# Altium schematic sheet RelayCard_LED_Monitor.SchDoc: Relay Card LED Monitor
size Tabloid; Date: 05/10/2023; Engineer: Terry D. Schevker; Revision: 1.0; SheetNumber: 2; SheetTotal: 2
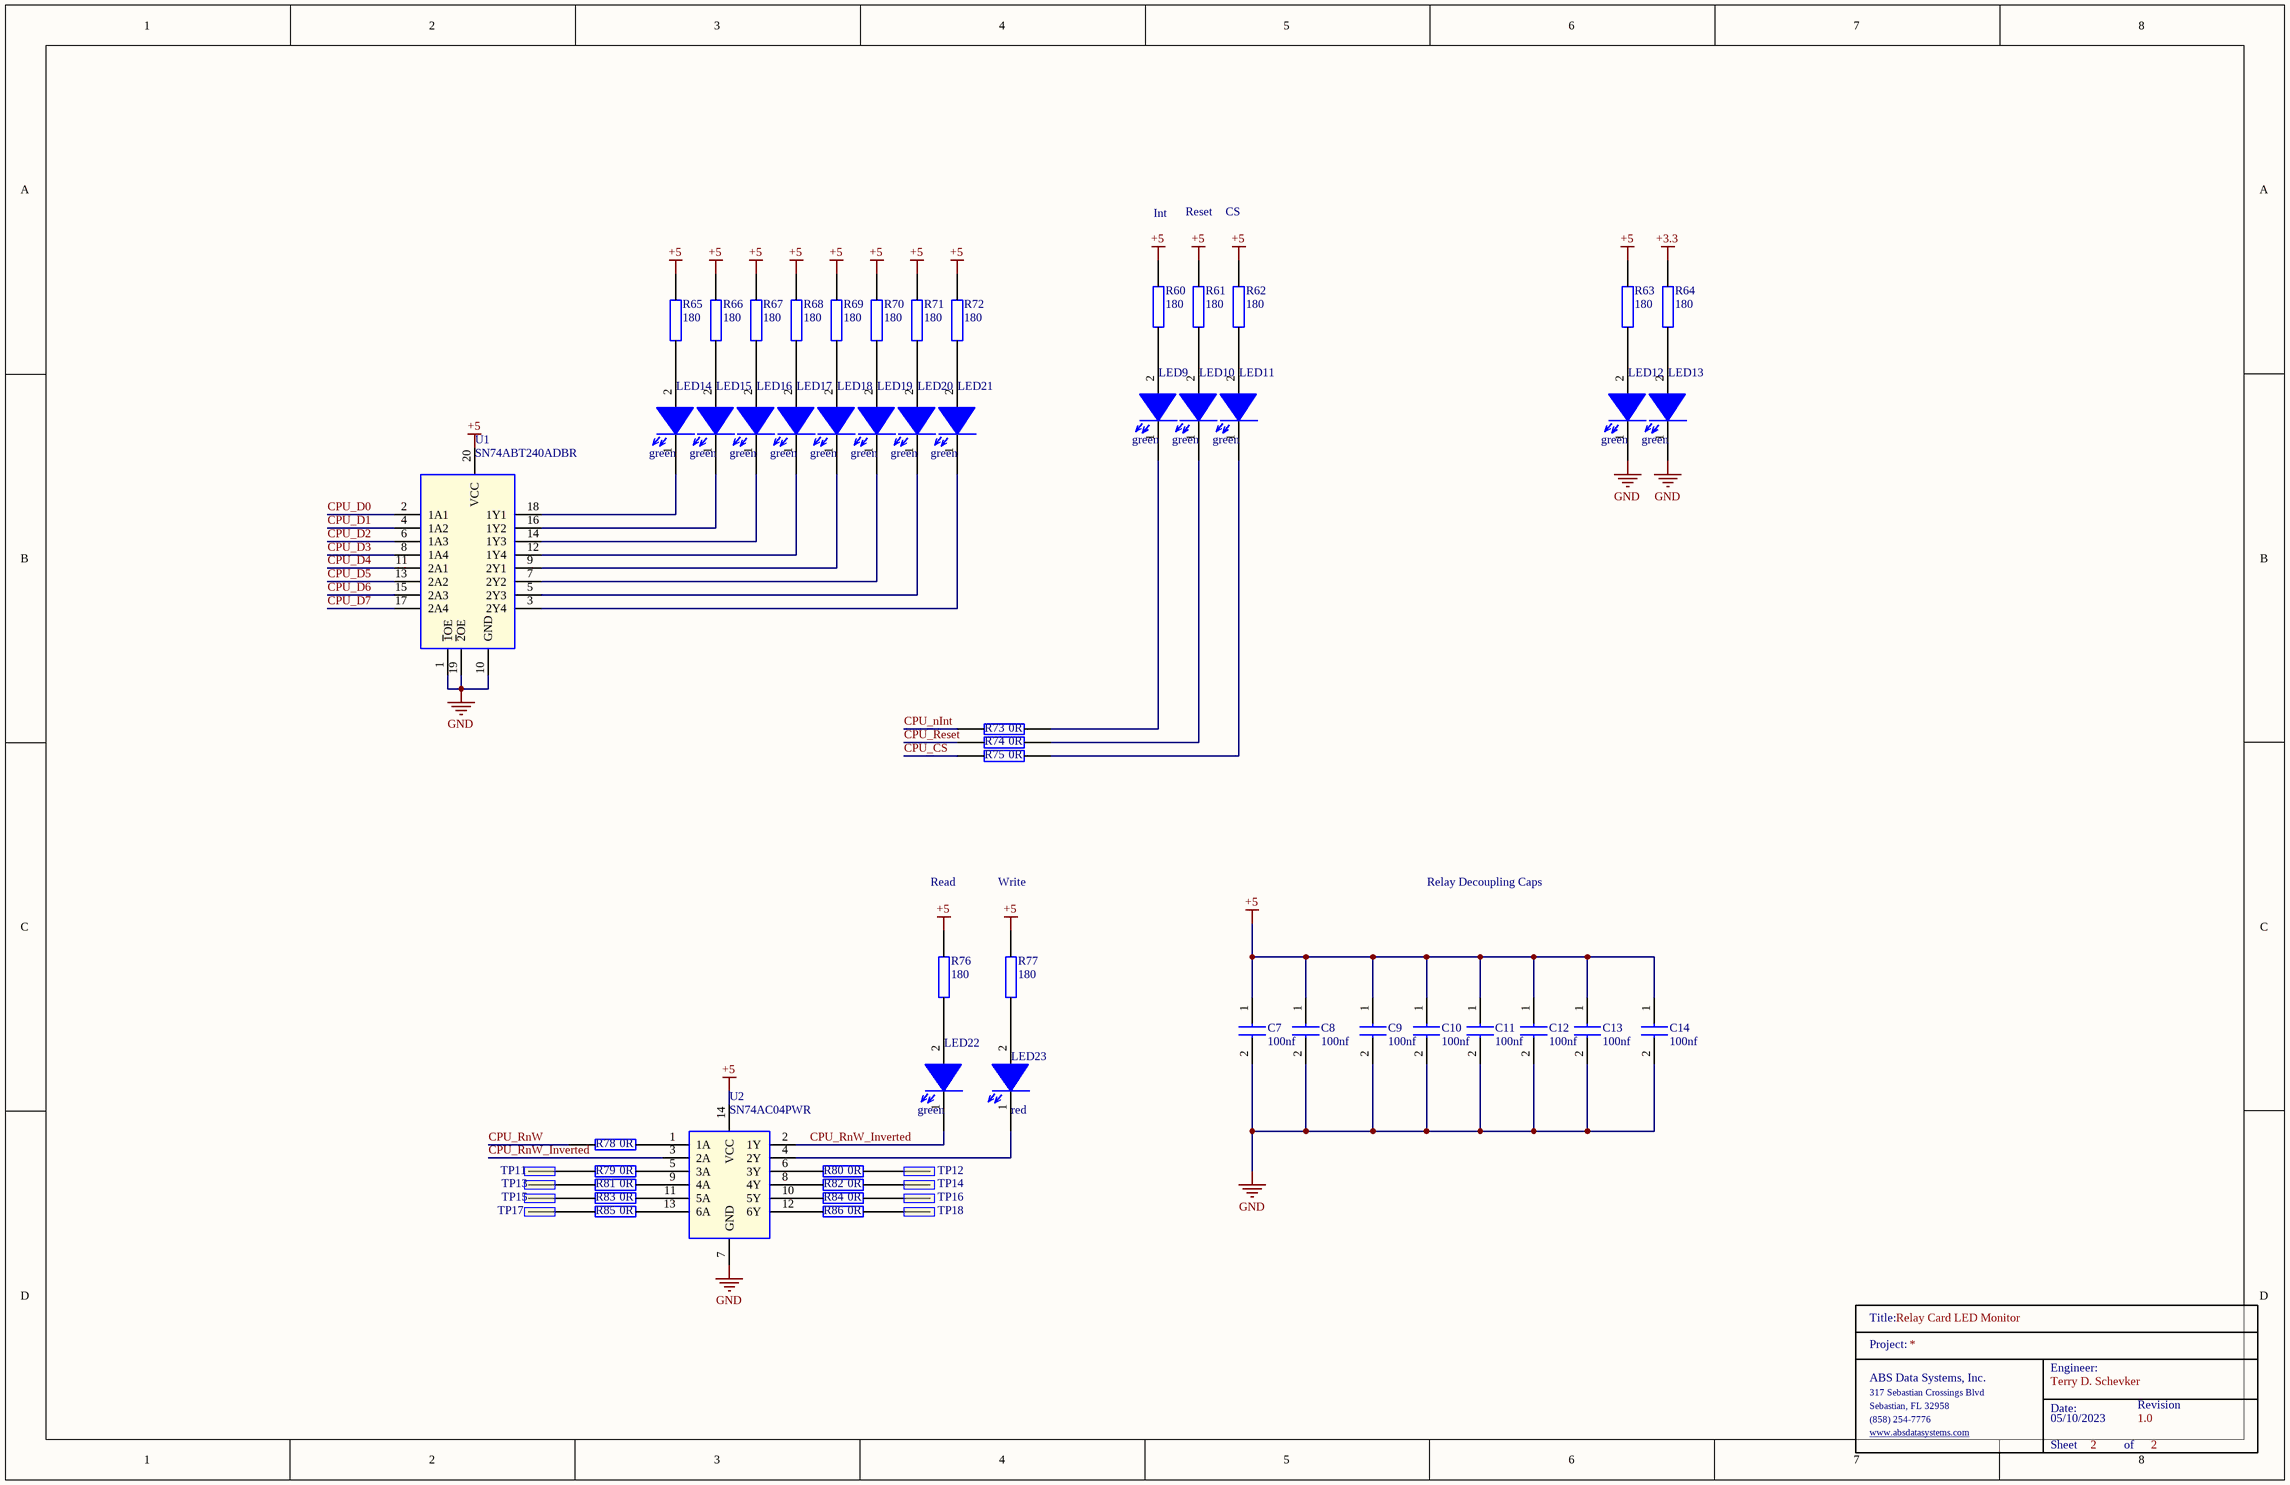
[diagram p0: RelayCard_LED_Monitor.SchDoc]

## Parts
C7  100nf  [0603]
C8  100nf  [0603]
C9  100nf  [0603]
C10  100nf  [0603]
C11  100nf  [0603]
C12  100nf  [0603]
C13  100nf  [0603]
C14  100nf  [0603]
LED9  green  [0603_Diode]
LED10  green  [0603_Diode]
LED11  green  [0603_Diode]
LED12  green  [0603_Diode]
LED13  green  [0603_Diode]
LED14  green  [0603_Diode]
LED15  green  [0603_Diode]
LED16  green  [0603_Diode]
LED17  green  [0603_Diode]
LED18  green  [0603_Diode]
LED19  green  [0603_Diode]
LED20  green  [0603_Diode]
LED21  green  [0603_Diode]
LED22  green  [0603_Diode]
LED23  red  [0603_Diode]
R60  180  [0603]
R61  180  [0603]
R62  180  [0603]
R63  180  [0603]
R64  180  [0603]
R65  180  [0603]
R66  180  [0603]
R67  180  [0603]
R68  180  [0603]
R69  180  [0603]
R70  180  [0603]
R71  180  [0603]
R72  180  [0603]
R73  0R  [0603]
R74  0R  [0603]
R75  0R  [0603]
R76  180  [0603]
R77  180  [0603]
R78  0R  [0603]
R79  0R  [0603]
R80  0R  [0603]
R81  0R  [0603]
R82  0R  [0603]
R83  0R  [0603]
R84  0R  [0603]
R85  0R  [0603]
R86  0R  [0603]
TitleBlock_2  TitleBlock  (value not drawn)  (graphical)
TP11  TP  [TP]  (value not drawn)
TP12  TP  [TP]  (value not drawn)
TP13  TP  [TP]  (value not drawn)
TP14  TP  [TP]  (value not drawn)
TP15  TP  [TP]  (value not drawn)
TP16  TP  [TP]  (value not drawn)
TP17  TP  [TP]  (value not drawn)
TP18  TP  [TP]  (value not drawn)
U1  SN74ABT240ADBR  [SOP65P780X200-20N]
U2  SN74AC04PWR  [SOP65P640X120-14N]

## Nets
+3.3: R64.2
+5: C7.1 C8.1 C9.1 C10.1 C11.1 C12.1 C13.1 C14.1 R60.2 R61.2 R62.2 R63.2 R65.2 R66.2 R67.2 R68.2 R69.2 R70.2 R71.2 R72.2 R76.2 R77.2 U1.20(VCC) U2.14(VCC)
GND: C7.2 C8.2 C9.2 C10.2 C11.2 C12.2 C13.2 C14.2 LED12.1(K) LED13.1(K) U1.1(~{1}OE) U1.10(GND) U1.19(~{2}OE) U2.7(GND)
CPU_CS: R75.1
CPU_D0: U1.2(1A1)
CPU_D1: U1.4(1A2)
CPU_D2: U1.6(1A3)
CPU_D3: U1.8(1A4)
CPU_D4: U1.11(2A1)
CPU_D5: U1.13(2A2)
CPU_D6: U1.15(2A3)
CPU_D7: U1.17(2A4)
CPU_nInt: R73.1
CPU_Reset: R74.1
CPU_RnW: R78.1
CPU_RnW_Inverted: LED22.1(K) U2.2(1Y) U2.3(2A)
NetLED9_1: LED9.1(K) R73.2
NetLED9_2: LED9.2(A) R60.1
NetLED10_1: LED10.1(K) R74.2
NetLED10_2: LED10.2(A) R61.1
NetLED11_1: LED11.1(K) R75.2
NetLED11_2: LED11.2(A) R62.1
NetLED12_2: LED12.2(A) R63.1
NetLED13_2: LED13.2(A) R64.1
NetLED14_1: LED14.1(K) U1.18(1Y1)
NetLED14_2: LED14.2(A) R65.1
NetLED15_1: LED15.1(K) U1.16(1Y2)
NetLED15_2: LED15.2(A) R66.1
NetLED16_1: LED16.1(K) U1.14(1Y3)
NetLED16_2: LED16.2(A) R67.1
NetLED17_1: LED17.1(K) U1.12(1Y4)
NetLED17_2: LED17.2(A) R68.1
NetLED18_1: LED18.1(K) U1.9(2Y1)
NetLED18_2: LED18.2(A) R69.1
NetLED19_1: LED19.1(K) U1.7(2Y2)
NetLED19_2: LED19.2(A) R70.1
NetLED20_1: LED20.1(K) U1.5(2Y3)
NetLED20_2: LED20.2(A) R71.1
NetLED21_1: LED21.1(K) U1.3(2Y4)
NetLED21_2: LED21.2(A) R72.1
NetLED22_2: LED22.2(A) R76.1
NetLED23_1: LED23.1(K) U2.4(2Y)
NetLED23_2: LED23.2(A) R77.1
NetR78_2: R78.2 U2.1(1A)
NetR79_1: R79.1 TP11.1
NetR79_2: R79.2 U2.5(3A)
NetR80_1: R80.1 U2.6(3Y)
NetR80_2: R80.2 TP12.1
NetR81_1: R81.1 TP13.1
NetR81_2: R81.2 U2.9(4A)
NetR82_1: R82.1 U2.8(4Y)
NetR82_2: R82.2 TP14.1
NetR83_1: R83.1 TP15.1
NetR83_2: R83.2 U2.11(5A)
NetR84_1: R84.1 U2.10(5Y)
NetR84_2: R84.2 TP16.1
NetR85_1: R85.1 TP17.1
NetR85_2: R85.2 U2.13(6A)
NetR86_1: R86.1 U2.12(6Y)
NetR86_2: R86.2 TP18.1

## Notes on the sheet
- Int
- Reset
- CS
- Read
- Write
- Relay Decoupling Caps
- (in symbol TitleBlock) Title:; Project:; Engineer:; ABS Data Systems, Inc.; 317 Sebastian Crossings Blvd; Sebastian, FL 32958; Date:; Revision; (858) 254-7776; www.absdatasystems.com; Sheet; of

## Library data of the parts
C7-C14 = CL10B104JB8NNNC: Samsung Electro-Mechanics 0603 100nf
LED9-LED22 = 150060GS75000: Wurth Elektronik 0603 green; Manufacturer: Wurth Electronics; Wavelength: 520nm; Viewing Angle: 140°; Lens Style: Clear,Rectangular; Luminous Intensity: 430mcd; Forward Current: 30mA; Forward Voltage: 3.2V; Test Current: 20mA; Supplier 1: Digi-Key; Manufacturer Part Number: 150060GS75000; RoHS: Yes; Category: LEDs; Stock 1: 71509; Pricing 1: 1=0.14000, 50=0.13300, 100=0.11400, 500=0.09900 (USD); Mount: Surface Mount; Case/Package: 0603; Color: Green; Case Code (Metric): 1608; Case Code (Imperial): 0603; Min Operating Temperature: -40°C; Max Operating Temperature: 85°C; Package Quantity: 4000; Packaging: Tape and Reel; Dominant Wavelength: 520nm; Length: 1.6mm; Width: 0.8mm; Height: 0.7mm; REACH SVHC: Unknown; Lead Free: Lead Free; ComponentLink1URL: https://datasheet.ciiva.com/29562/150060gs75000-29562868.pdf?src-supplier=Digi-Key; ComponentLink1Description: https://datasheet.ciiva.com/29562/150060gs75000-29562868.pdf?src-supplier=Digi-Key; ComponentLink2URL: https://datasheet.ciiva.com/29279/759427-da-01-en-chipled-0603-w-kl-gruen-150060gs75000-29279201.pdf?src-supplier=Conrad; ComponentLink2Description: https://datasheet.ciiva.com/29279/759427-da-01-en-chipled-0603-w-kl-gruen-150060gs75000-29279201.pdf?src-supplier=Conrad; ComponentLink3URL: https://datasheet.ciiva.com/29562/150060gs75000-29562869.pdf?src-supplier=Digi-Key; ComponentLink3Description: https://datasheet.ciiva.com/29562/150060gs75000-29562869.pdf?src-supplier=Digi-Key; ComponentLink4URL: https://datasheet.ciiva.com/29562/150060gs75000-29562870.pdf?src-supplier=Digi-Key; ComponentLink4Description: https://datasheet.ciiva.com/29562/150060gs75000-29562870.pdf?src-supplier=Digi-Key
LED23 = 150060RS75000: Wurth Elektronik 0603 red; Manufacturer: Wurth Electronics; Manufacturer Part Number: 150060GS75000; Color: Green; Wavelength: 520nm; Viewing Angle: 140°; Lens Style: Clear,Rectangular; Luminous Intensity: 430mcd; Forward Current: 30mA; Forward Voltage: 3.2V; Test Current: 20mA; Supplier 1: Digi-Key; RoHS: Yes; Category: LEDs; Stock 1: 71509; Pricing 1: 1=0.14000, 50=0.13300, 100=0.11400, 500=0.09900 (USD); Mount: Surface Mount; Case/Package: 0603; Case Code (Metric): 1608; Case Code (Imperial): 0603; Min Operating Temperature: -40°C; Max Operating Temperature: 85°C; Package Quantity: 4000; Packaging: Tape and Reel; Dominant Wavelength: 520nm; Length: 1.6mm; Width: 0.8mm; Height: 0.7mm; REACH SVHC: Unknown; Lead Free: Lead Free; ComponentLink1URL: https://datasheet.ciiva.com/29562/150060gs75000-29562868.pdf?src-supplier=Digi-Key; ComponentLink1Description: https://datasheet.ciiva.com/29562/150060gs75000-29562868.pdf?src-supplier=Digi-Key; ComponentLink2URL: https://datasheet.ciiva.com/29279/759427-da-01-en-chipled-0603-w-kl-gruen-150060gs75000-29279201.pdf?src-supplier=Conrad; ComponentLink2Description: https://datasheet.ciiva.com/29279/759427-da-01-en-chipled-0603-w-kl-gruen-150060gs75000-29279201.pdf?src-supplier=Conrad; ComponentLink3URL: https://datasheet.ciiva.com/29562/150060gs75000-29562869.pdf?src-supplier=Digi-Key; ComponentLink3Description: https://datasheet.ciiva.com/29562/150060gs75000-29562869.pdf?src-supplier=Digi-Key; ComponentLink4URL: https://datasheet.ciiva.com/29562/150060gs75000-29562870.pdf?src-supplier=Digi-Key; ComponentLink4Description: https://datasheet.ciiva.com/29562/150060gs75000-29562870.pdf?src-supplier=Digi-Key
R60-R72 R76 R77 = RC0603FR-13180RL: YAGEO 0603 180 ohm; Manufacturer_Name: KEMET; Manufacturer_Part_Number: RC0603JR-070RL; Geometry.Height: 0.55mm; Mouser Part Number: 603-RC0603JR-070RL; Mouser Price/Stock: https://www.mouser.co.uk/ProductDetail/YAGEO/RC0603JR-070RL?qs=2cAdsCoAWRGWyPcuXgGiXQ%3D%3D; Datasheet Link: https://datasheet.datasheetarchive.com/originals/distributors/Datasheets_SAMA/902f9e387b938f871d31120f5fc1d65e.pdf
R73-R75 R78-R86 = RC0603JR-070RL: YAGEO 0603 0 ohm; Manufacturer_Name: KEMET; Geometry.Height: 0.55mm; Mouser Part Number: 603-RC0603JR-070RL; Mouser Price/Stock: https://www.mouser.co.uk/ProductDetail/YAGEO/RC0603JR-070RL?qs=2cAdsCoAWRGWyPcuXgGiXQ%3D%3D; Manufacturer_Part_Number: RC0603JR-070RL; Datasheet Link: https://datasheet.datasheetarchive.com/originals/distributors/Datasheets_SAMA/902f9e387b938f871d31120f5fc1d65e.pdf
TP11-TP18 = TP: Manufacturer: Samtec; Manufacturer Part Number: TST-105-01-G-D; Number of Contacts: 16; Gender: Male; Connector Type: Male Pin; Pitch: 2.54mm; Row Spacing: 0.1inch; Supplier 1: Digi-Key; RoHS: Yes; Category: Headers and Wire Housings; Stock 1: 227; Pricing 1: 1=2.85000, 10=2.73600, 100=2.28000, 500=1.93800, 1000=1.65300, 5000=1.48200 (USD); Mount: Through Hole; Contact Plating: Gold; Contact Material: Bronze; Housing Material: Polyester; Housing Color: Black; Color: Black; Min Operating Temperature: -55°C; Max Operating Temperature: 125°C; Number of Rows: 2; Termination: Solder; Packaging: Rail/Tube; Orientation: Straight; Number of Positions: 16; Length: 27.94mm; Depth: 9.27mm; Contact Mating Length: 0.25inch; REACH SVHC: No SVHC; ComponentLink1URL: https://datasheet.ciiva.com/739/tst-mkt-739845.pdf?src-supplier=Digi-Key; ComponentLink1Description: https://datasheet.ciiva.com/739/tst-mkt-739845.pdf?src-supplier=Digi-Key; ComponentLink2URL: https://datasheet.ciiva.com/10018/htst-10018510.pdf?src-supplier=Avnet; ComponentLink2Description: https://datasheet.ciiva.com/10018/htst-10018510.pdf?src-supplier=Avnet
U1 = SN74ABT240ADBR: Octal Buffers/Drivers With 3-State Outputs; Manufacturer_Name: Texas Instruments; Geometry.Height: 2mm; Mouser Part Number: 595-SN74ABT240ADBR; Mouser Price/Stock: https://www.mouser.co.uk/ProductDetail/Texas-Instruments/SN74ABT240ADBR?qs=JHHQeKcAU3Dt82k%252BVyiYdw%3D%3D; Manufacturer_Part_Number: SN74ABT240ADBR; Datasheet Link: http://www.ti.com/lit/gpn/sn74abt240a
U2 = SN74AC04PWR: Hex Inverters; Manufacturer_Name: Texas Instruments; Geometry.Height: 1.2mm; Mouser Part Number: 595-SN74AC04PWR; Mouser Price/Stock: https://www.mouser.co.uk/ProductDetail/Texas-Instruments/SN74AC04PWR?qs=RZS%252BpEsUn7pRvPNqsga4SA%3D%3D; Manufacturer_Part_Number: SN74AC04PWR; Datasheet Link: http://www.ti.com/lit/gpn/sn74ac04